# Altium schematic sheet 0041_PCH_PWR_GND.SchDoc
size 848 x 558 mm
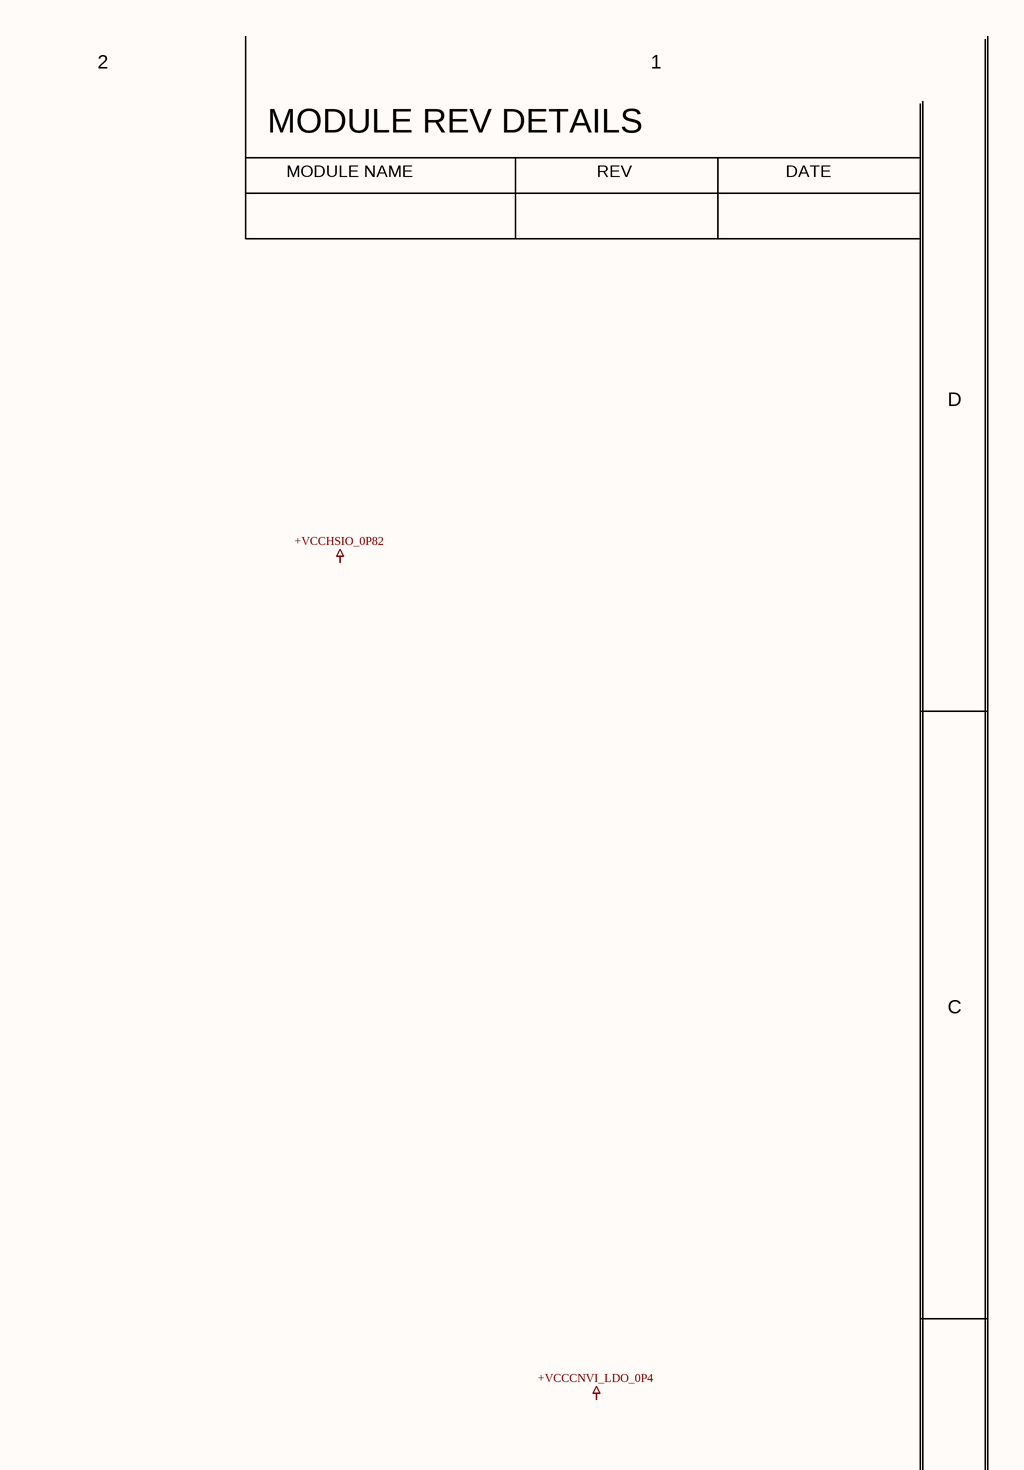
[diagram p0: 0041_PCH_PWR_GND.SchDoc, top right]
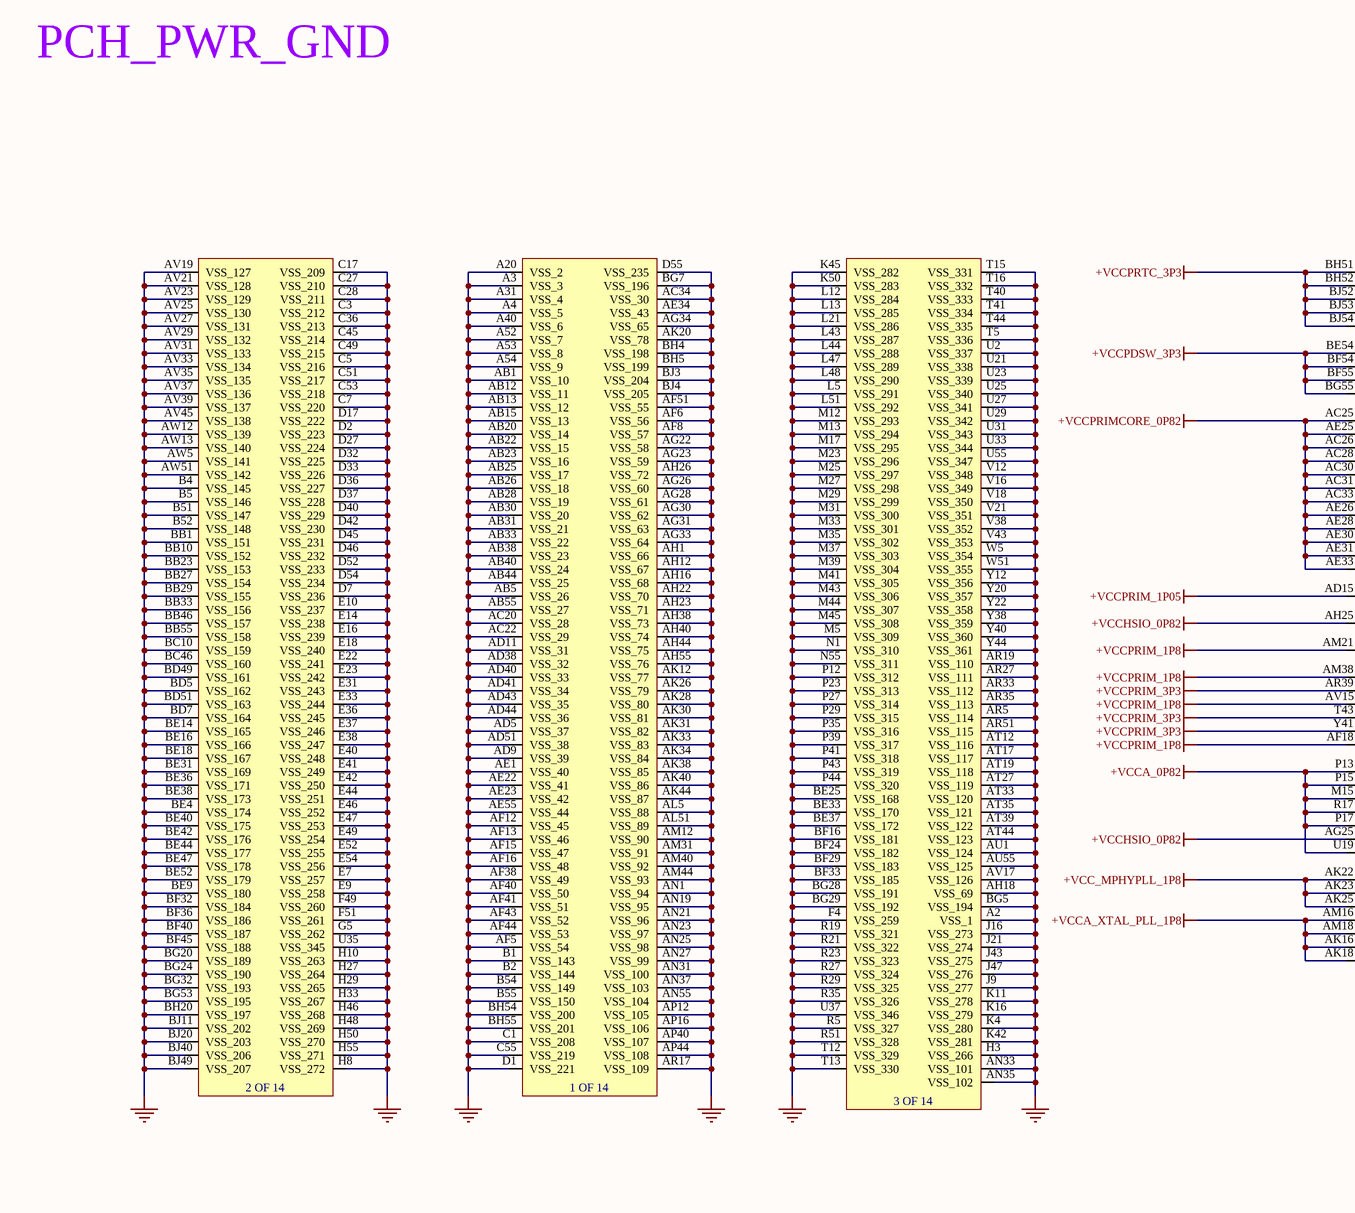
[diagram p1: 0041_PCH_PWR_GND.SchDoc, bottom left]
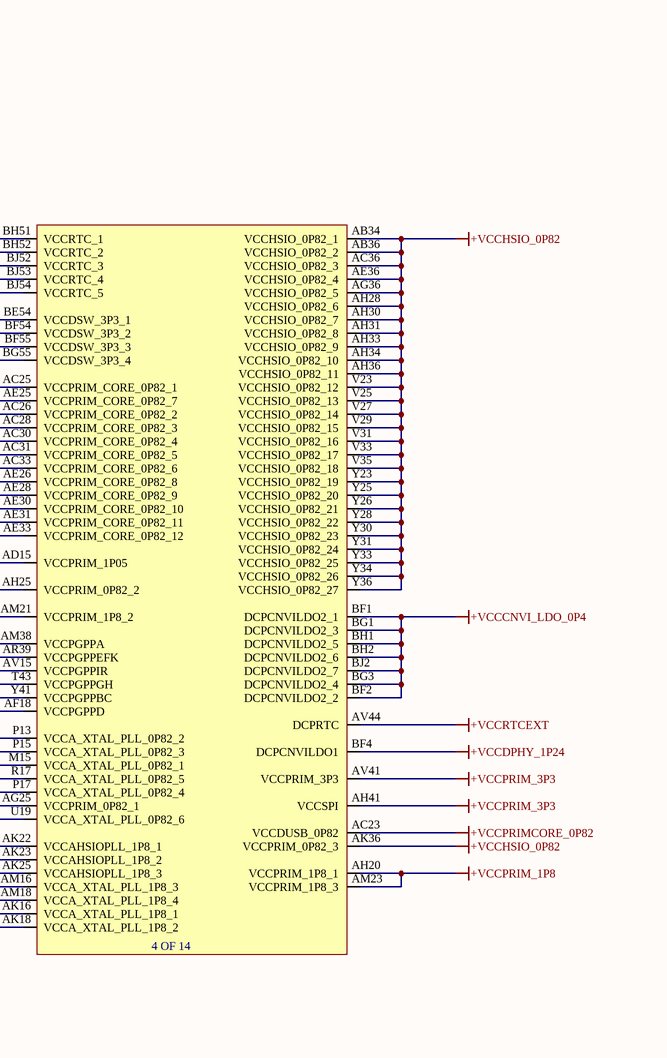
[diagram p2: 0041_PCH_PWR_GND.SchDoc, bottom middle]
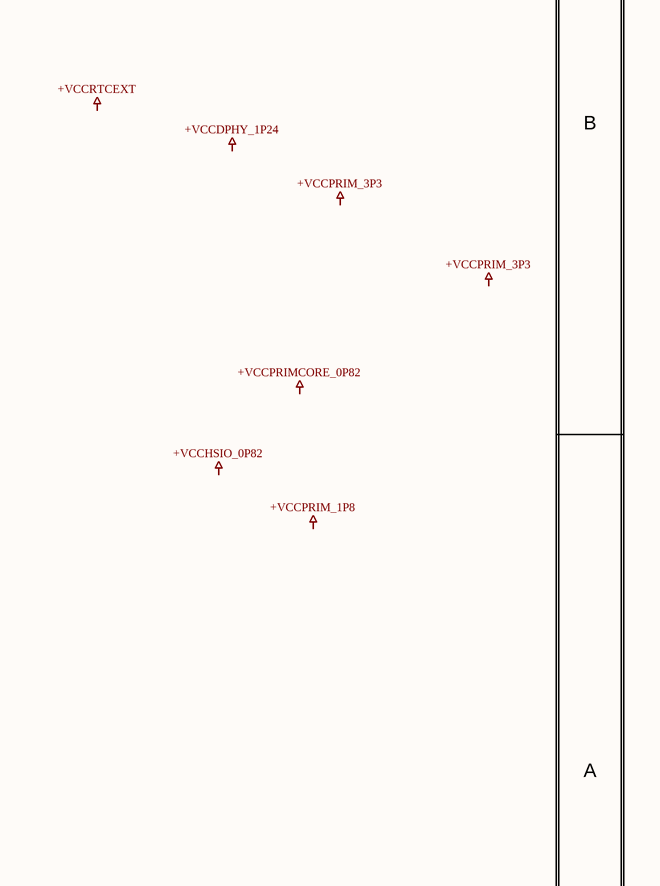
[diagram p3: 0041_PCH_PWR_GND.SchDoc, bottom right]

## Parts
U23601  C_RPL_S_PCH_EXT  (value not drawn)  (parts A,B,C of 14)
U?  C_RPL_S_PCH_EXT  (value not drawn)  (part D of 14)

## Nets
+VCC_MPHYPLL_1P8: U?.AK22(VCCAHSIOPLL_1P8_1) U?.AK23(VCCAHSIOPLL_1P8_2) U?.AK25(VCCAHSIOPLL_1P8_3)
+VCCA_0P82: U?.M15(VCCA_XTAL_PLL_0P82_1) U?.P13(VCCA_XTAL_PLL_0P82_2) U?.P15(VCCA_XTAL_PLL_0P82_3) U?.P17(VCCA_XTAL_PLL_0P82_4) U?.R17(VCCA_XTAL_PLL_0P82_5) U?.U19(VCCA_XTAL_PLL_0P82_6)
+VCCA_XTAL_PLL_1P8: U?.AK16(VCCA_XTAL_PLL_1P8_1) U?.AK18(VCCA_XTAL_PLL_1P8_2) U?.AM16(VCCA_XTAL_PLL_1P8_3) U?.AM18(VCCA_XTAL_PLL_1P8_4)
+VCCCNVI_LDO_0P4: U?.BF1(DCPCNVILDO2_1) U?.BF2(DCPCNVILDO2_2) U?.BG1(DCPCNVILDO2_3) U?.BG3(DCPCNVILDO2_4) U?.BH1(DCPCNVILDO2_5) U?.BH2(DCPCNVILDO2_6) U?.BJ2(DCPCNVILDO2_7)
+VCCDPHY_1P24: U?.BF4(DCPCNVILDO1)
+VCCHSIO_0P82: U?.AB34(VCCHSIO_0P82_1) U?.AB36(VCCHSIO_0P82_2) U?.AC36(VCCHSIO_0P82_3) U?.AE36(VCCHSIO_0P82_4) U?.AG25(VCCPRIM_0P82_1) U?.AG36(VCCHSIO_0P82_5) U?.AH25(VCCPRIM_0P82_2) U?.AH28(VCCHSIO_0P82_6) U?.AH30(VCCHSIO_0P82_7) U?.AH31(VCCHSIO_0P82_8) U?.AH33(VCCHSIO_0P82_9) U?.AH34(VCCHSIO_0P82_10) U?.AH36(VCCHSIO_0P82_11) U?.AK36(VCCPRIM_0P82_3) U?.V23(VCCHSIO_0P82_12) U?.V25(VCCHSIO_0P82_13) U?.V27(VCCHSIO_0P82_14) U?.V29(VCCHSIO_0P82_15) U?.V31(VCCHSIO_0P82_16) U?.V33(VCCHSIO_0P82_17) U?.V35(VCCHSIO_0P82_18) U?.Y23(VCCHSIO_0P82_19) U?.Y25(VCCHSIO_0P82_20) U?.Y26(VCCHSIO_0P82_21) U?.Y28(VCCHSIO_0P82_22) U?.Y30(VCCHSIO_0P82_23) U?.Y31(VCCHSIO_0P82_24) U?.Y33(VCCHSIO_0P82_25) U?.Y34(VCCHSIO_0P82_26) U?.Y36(VCCHSIO_0P82_27)
+VCCPDSW_3P3: U?.BE54(VCCDSW_3P3_1) U?.BF54(VCCDSW_3P3_2) U?.BF55(VCCDSW_3P3_3) U?.BG55(VCCDSW_3P3_4)
+VCCPRIM_1P05: U?.AD15(VCCPRIM_1P05)
+VCCPRIM_1P8: U?.AF18(VCCPGPPD) U?.AH20(VCCPRIM_1P8_1) U?.AM21(VCCPRIM_1P8_2) U?.AM23(VCCPRIM_1P8_3) U?.AM38(VCCPGPPA) U?.AV15(VCCPGPPIR)
+VCCPRIM_3P3: U?.AH41(VCCSPI) U?.AR39(VCCPGPPEFK) U?.AV41(VCCPRIM_3P3) U?.T43(VCCPGPPGH) U?.Y41(VCCPGPPBC)
+VCCPRIMCORE_0P82: U?.AC23(VCCDUSB_0P82) U?.AC25(VCCPRIM_CORE_0P82_1) U?.AC26(VCCPRIM_CORE_0P82_2) U?.AC28(VCCPRIM_CORE_0P82_3) U?.AC30(VCCPRIM_CORE_0P82_4) U?.AC31(VCCPRIM_CORE_0P82_5) U?.AC33(VCCPRIM_CORE_0P82_6) U?.AE25(VCCPRIM_CORE_0P82_7) U?.AE26(VCCPRIM_CORE_0P82_8) U?.AE28(VCCPRIM_CORE_0P82_9) U?.AE30(VCCPRIM_CORE_0P82_10) U?.AE31(VCCPRIM_CORE_0P82_11) U?.AE33(VCCPRIM_CORE_0P82_12)
+VCCPRTC_3P3: U?.BH51(VCCRTC_1) U?.BH52(VCCRTC_2) U?.BJ52(VCCRTC_3) U?.BJ53(VCCRTC_4) U?.BJ54(VCCRTC_5)
+VCCRTCEXT: U?.AV44(DCPRTC)
GND: U23601.A2(VSS_1) U23601.A3(VSS_3) U23601.A4(VSS_5) U23601.A20(VSS_2) U23601.A31(VSS_4) U23601.A40(VSS_6) U23601.A52(VSS_7) U23601.A53(VSS_8) U23601.A54(VSS_9) U23601.AB1(VSS_10) U23601.AB5(VSS_26) U23601.AB12(VSS_11) U23601.AB13(VSS_12) U23601.AB15(VSS_13) U23601.AB20(VSS_14) U23601.AB22(VSS_15) U23601.AB23(VSS_16) U23601.AB25(VSS_17) U23601.AB26(VSS_18) U23601.AB28(VSS_19) U23601.AB30(VSS_20) U23601.AB31(VSS_21) U23601.AB33(VSS_22) U23601.AB38(VSS_23) U23601.AB40(VSS_24) U23601.AB44(VSS_25) U23601.AB55(VSS_27) U23601.AC20(VSS_28) U23601.AC22(VSS_29) U23601.AC34(VSS_30) U23601.AD5(VSS_37) U23601.AD9(VSS_39) U23601.AD11(VSS_31) U23601.AD38(VSS_32) U23601.AD40(VSS_33) U23601.AD41(VSS_34) U23601.AD43(VSS_35) U23601.AD44(VSS_36) U23601.AD51(VSS_38) U23601.AE1(VSS_40) U23601.AE22(VSS_41) U23601.AE23(VSS_42) U23601.AE34(VSS_43) U23601.AE55(VSS_44) U23601.AF5(VSS_54) U23601.AF6(VSS_56) U23601.AF8(VSS_57) U23601.AF12(VSS_45) U23601.AF13(VSS_46) U23601.AF15(VSS_47) U23601.AF16(VSS_48) U23601.AF38(VSS_49) U23601.AF40(VSS_50) U23601.AF41(VSS_51) U23601.AF43(VSS_52) U23601.AF44(VSS_53) U23601.AF51(VSS_55) U23601.AG22(VSS_58) U23601.AG23(VSS_59) U23601.AG26(VSS_60) U23601.AG28(VSS_61) U23601.AG30(VSS_62) U23601.AG31(VSS_63) U23601.AG33(VSS_64) U23601.AG34(VSS_65) U23601.AH1(VSS_66) U23601.AH12(VSS_67) U23601.AH16(VSS_68) U23601.AH18(VSS_69) U23601.AH22(VSS_70) U23601.AH23(VSS_71) U23601.AH26(VSS_72) U23601.AH38(VSS_73) U23601.AH40(VSS_74) U23601.AH44(VSS_75) U23601.AH55(VSS_76) U23601.AK12(VSS_77) U23601.AK20(VSS_78) U23601.AK26(VSS_79) U23601.AK28(VSS_80) U23601.AK30(VSS_81) U23601.AK31(VSS_82) U23601.AK33(VSS_83) U23601.AK34(VSS_84) U23601.AK38(VSS_85) U23601.AK40(VSS_86) U23601.AK44(VSS_87) U23601.AL5(VSS_88) U23601.AL51(VSS_89) U23601.AM12(VSS_90) U23601.AM31(VSS_91) U23601.AM40(VSS_92) U23601.AM44(VSS_93) U23601.AN1(VSS_94) U23601.AN19(VSS_95) U23601.AN21(VSS_96) U23601.AN23(VSS_97) U23601.AN25(VSS_98) U23601.AN27(VSS_99) U23601.AN31(VSS_100) U23601.AN33(VSS_101) U23601.AN35(VSS_102) U23601.AN37(VSS_103) U23601.AN55(VSS_104) U23601.AP12(VSS_105) U23601.AP16(VSS_106) U23601.AP40(VSS_107) U23601.AP44(VSS_108) U23601.AR5(VSS_114) U23601.AR17(VSS_109) U23601.AR19(VSS_110) U23601.AR27(VSS_111) U23601.AR33(VSS_112) U23601.AR35(VSS_113) U23601.AR51(VSS_115) U23601.AT12(VSS_116) U23601.AT17(VSS_117) U23601.AT19(VSS_118) U23601.AT27(VSS_119) U23601.AT33(VSS_120) U23601.AT35(VSS_121) U23601.AT39(VSS_122) U23601.AT44(VSS_123) U23601.AU1(VSS_124) U23601.AU55(VSS_125) U23601.AV17(VSS_126) U23601.AV19(VSS_127) U23601.AV21(VSS_128) U23601.AV23(VSS_129) U23601.AV25(VSS_130) U23601.AV27(VSS_131) U23601.AV29(VSS_132) U23601.AV31(VSS_133) U23601.AV33(VSS_134) U23601.AV35(VSS_135) U23601.AV37(VSS_136) U23601.AV39(VSS_137) U23601.AV45(VSS_138) U23601.AW5(VSS_141) U23601.AW12(VSS_139) U23601.AW13(VSS_140) U23601.AW51(VSS_142) U23601.B1(VSS_143) U23601.B2(VSS_144) U23601.B4(VSS_145) U23601.B5(VSS_146) U23601.B51(VSS_147) U23601.B52(VSS_148) U23601.B54(VSS_149) U23601.B55(VSS_150) U23601.BB1(VSS_151) U23601.BB10(VSS_152) U23601.BB23(VSS_153) U23601.BB27(VSS_154) U23601.BB29(VSS_155) U23601.BB33(VSS_156) U23601.BB46(VSS_157) U23601.BB55(VSS_158) U23601.BC10(VSS_159) U23601.BC46(VSS_160) U23601.BD5(VSS_162) U23601.BD7(VSS_164) U23601.BD49(VSS_161) U23601.BD51(VSS_163) U23601.BE4(VSS_174) U23601.BE9(VSS_180) U23601.BE14(VSS_165) U23601.BE16(VSS_166) U23601.BE18(VSS_167) U23601.BE25(VSS_168) U23601.BE31(VSS_169) U23601.BE33(VSS_170) U23601.BE36(VSS_171) U23601.BE37(VSS_172) U23601.BE38(VSS_173) U23601.BE40(VSS_175) U23601.BE42(VSS_176) U23601.BE44(VSS_177) U23601.BE47(VSS_178) U23601.BE52(VSS_179) U23601.BF16(VSS_181) U23601.BF24(VSS_182) U23601.BF29(VSS_183) U23601.BF32(VSS_184) U23601.BF33(VSS_185) U23601.BF36(VSS_186) U23601.BF40(VSS_187) U23601.BF45(VSS_188) U23601.BG5(VSS_194) U23601.BG7(VSS_196) U23601.BG20(VSS_189) U23601.BG24(VSS_190) U23601.BG28(VSS_191) U23601.BG29(VSS_192) U23601.BG32(VSS_193) U23601.BG53(VSS_195) U23601.BH4(VSS_198) U23601.BH5(VSS_199) U23601.BH20(VSS_197) U23601.BH54(VSS_200) U23601.BH55(VSS_201) U23601.BJ3(VSS_204) U23601.BJ4(VSS_205) U23601.BJ11(VSS_202) U23601.BJ20(VSS_203) U23601.BJ40(VSS_206) U23601.BJ49(VSS_207) U23601.C1(VSS_208) U23601.C3(VSS_212) U23601.C5(VSS_216) U23601.C7(VSS_220) U23601.C17(VSS_209) U23601.C27(VSS_210) U23601.C28(VSS_211) U23601.C36(VSS_213) U23601.C45(VSS_214) U23601.C49(VSS_215) U23601.C51(VSS_217) U23601.C53(VSS_218) U23601.C55(VSS_219) U23601.D1(VSS_221) U23601.D2(VSS_223) U23601.D7(VSS_236) U23601.D17(VSS_222) U23601.D27(VSS_224) U23601.D32(VSS_225) U23601.D33(VSS_226) U23601.D36(VSS_227) U23601.D37(VSS_228) U23601.D40(VSS_229) U23601.D42(VSS_230) U23601.D45(VSS_231) U23601.D46(VSS_232) U23601.D52(VSS_233) U23601.D54(VSS_234) U23601.D55(VSS_235) U23601.E7(VSS_257) U23601.E9(VSS_258) U23601.E10(VSS_237) U23601.E14(VSS_238) U23601.E16(VSS_239) U23601.E18(VSS_240) U23601.E22(VSS_241) U23601.E23(VSS_242) U23601.E31(VSS_243) U23601.E33(VSS_244) U23601.E36(VSS_245) U23601.E37(VSS_246) U23601.E38(VSS_247) U23601.E40(VSS_248) U23601.E41(VSS_249) U23601.E42(VSS_250) U23601.E44(VSS_251) U23601.E46(VSS_252) U23601.E47(VSS_253) U23601.E49(VSS_254) U23601.E52(VSS_255) U23601.E54(VSS_256) U23601.F4(VSS_259) U23601.F49(VSS_260) U23601.F51(VSS_261) U23601.G5(VSS_262) U23601.H3(VSS_266) U23601.H8(VSS_272) U23601.H10(VSS_263) U23601.H27(VSS_264) U23601.H29(VSS_265) U23601.H33(VSS_267) U23601.H46(VSS_268) U23601.H48(VSS_269) U23601.H50(VSS_270) U23601.H55(VSS_271) U23601.J9(VSS_277) U23601.J16(VSS_273) U23601.J21(VSS_274) U23601.J43(VSS_275) U23601.J47(VSS_276) U23601.K4(VSS_280) U23601.K11(VSS_278) U23601.K16(VSS_279) U23601.K42(VSS_281) U23601.K45(VSS_282) U23601.K50(VSS_283) U23601.L5(VSS_291) U23601.L12(VSS_284) U23601.L13(VSS_285) U23601.L21(VSS_286) U23601.L43(VSS_287) U23601.L44(VSS_288) U23601.L47(VSS_289) U23601.L48(VSS_290) U23601.L51(VSS_292) U23601.M5(VSS_309) U23601.M12(VSS_293) U23601.M13(VSS_294) U23601.M17(VSS_295) U23601.M23(VSS_296) U23601.M25(VSS_297) U23601.M27(VSS_298) U23601.M29(VSS_299) U23601.M31(VSS_300) U23601.M33(VSS_301) U23601.M35(VSS_302) U23601.M37(VSS_303) U23601.M39(VSS_304) U23601.M41(VSS_305) U23601.M43(VSS_306) U23601.M44(VSS_307) U23601.M45(VSS_308) U23601.N1(VSS_310) U23601.N55(VSS_311) U23601.P12(VSS_312) U23601.P23(VSS_313) U23601.P27(VSS_314) U23601.P29(VSS_315) U23601.P35(VSS_316) U23601.P39(VSS_317) U23601.P41(VSS_318) U23601.P43(VSS_319) U23601.P44(VSS_320) U23601.R5(VSS_327) U23601.R19(VSS_321) U23601.R21(VSS_322) U23601.R23(VSS_323) U23601.R27(VSS_324) U23601.R29(VSS_325) U23601.R35(VSS_326) U23601.R51(VSS_328) U23601.T5(VSS_336) U23601.T12(VSS_329) U23601.T13(VSS_330) U23601.T15(VSS_331) U23601.T16(VSS_332) U23601.T40(VSS_333) U23601.T41(VSS_334) U23601.T44(VSS_335) U23601.U2(VSS_337) U23601.U21(VSS_338) U23601.U23(VSS_339) U23601.U25(VSS_340) U23601.U27(VSS_341) U23601.U29(VSS_342) U23601.U31(VSS_343) U23601.U33(VSS_344) U23601.U35(VSS_345) U23601.U37(VSS_346) U23601.U55(VSS_347) U23601.V12(VSS_348) U23601.V16(VSS_349) U23601.V18(VSS_350) U23601.V21(VSS_351) U23601.V38(VSS_352) U23601.V43(VSS_353) U23601.W5(VSS_354) U23601.W51(VSS_355) U23601.Y12(VSS_356) U23601.Y20(VSS_357) U23601.Y22(VSS_358) U23601.Y38(VSS_359) U23601.Y40(VSS_360) U23601.Y44(VSS_361)

## Notes on the sheet
- 2
- 1
- MODULE REV DETAILS
- MODULE NAME
- REV
- DATE
- D
- C
- PCH_PWR_GND
- B
- A
- Labels drawn without touching a wire or pin: +VCCCNVI_LDO_0P4, +VCCDPHY_1P24, +VCCHSIO_0P82, +VCCPRIM_1P8, +VCCPRIM_3P3, +VCCPRIMCORE_0P82, +VCCRTCEXT
- (in symbol C_RPL_S_PCH_EXT, part A) 1 OF 14
- (in symbol C_RPL_S_PCH_EXT, part B) 2 OF 14
- (in symbol C_RPL_S_PCH_EXT, part C) 3 OF 14
- (in symbol C_RPL_S_PCH_EXT, part D) 4 OF 14

## Library data of the parts
U23601 U? = C_RPL_S_PCH_EXT: Manufacturer Part Number: *; Case/Package: *